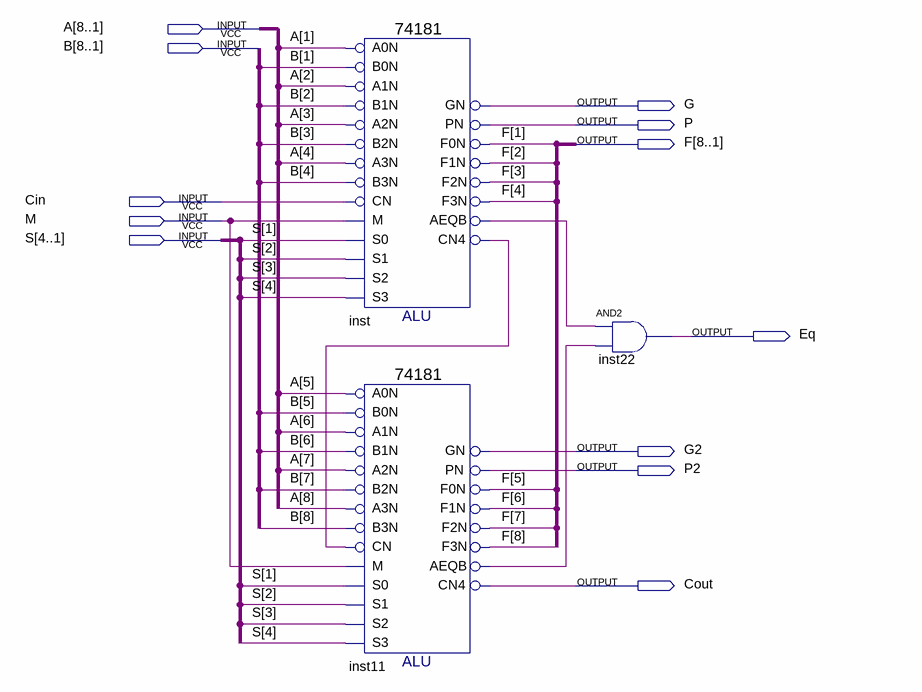
[diagram p0: schematic sheet]
// Quartus schematic alu8b_sch.bdf as structural Verilog: 3 symbols, 12 pins
module alu8b_sch (
  input  [8:1] A,
  input  [8:1] B,
  input  Cin,
  input  M,
  input  [4:1] S,
  output G,
  output P,
  output [8:1] F,
  output Eq,
  output G2,
  output P2,
  output Cout
);

  wire inst11_aeqb, inst_aeqb, inst_cn4;

  \74181  inst (
    .B0N(B[1]), .A0N(A[1]), .A1N(A[2]), .B1N(B[2]), .A3N(A[4]), .B2N(B[3]), .A2N(A[3]), .M(M), .CN(Cin),
    .B3N(B[4]), .S2(S[3]), .S1(S[2]), .S0(S[1]), .S3(S[4]), .PN(P), .GN(G), .F3N(F[4]), .F1N(F[2]),
    .F0N(F[1]), .AEQB(inst_aeqb), .CN4(inst_cn4), .F2N(F[3]));
  \74181  inst11 (
    .B0N(B[5]), .A0N(A[5]), .A1N(A[6]), .B1N(B[6]), .A3N(A[8]), .B2N(B[7]), .A2N(A[7]), .M(M), .CN(inst_cn4),
    .B3N(B[8]), .S2(S[3]), .S1(S[2]), .S0(S[1]), .S3(S[4]), .PN(P2), .GN(G2), .F3N(F[8]), .F1N(F[6]),
    .F0N(F[5]), .AEQB(inst11_aeqb), .CN4(Cout), .F2N(F[7]));
  and inst22 (Eq, inst_aeqb, inst11_aeqb);
endmodule
